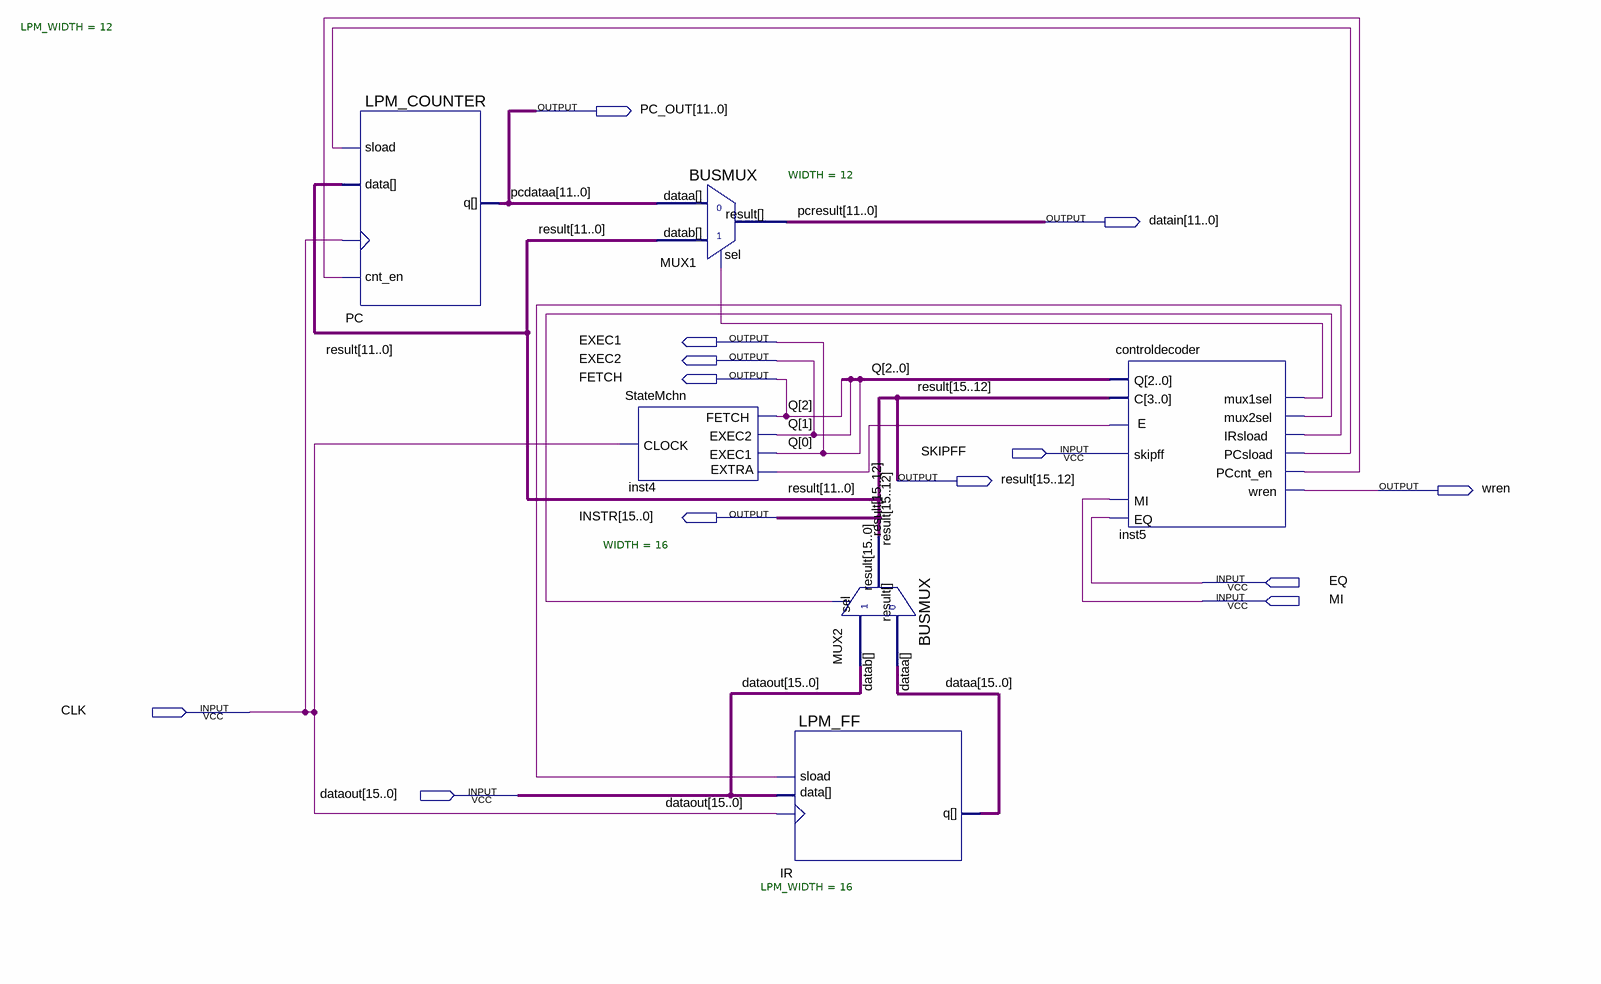
[diagram p0: schematic sheet]
// Quartus schematic ControlPath.bdf as structural Verilog: 6 symbols, 13 pins
module ControlPath (
  input  SKIPFF,
  input  EQ,
  input  MI,
  input  CLK,
  input  [15:0] dataout,
  output [11:0] PC_OUT,
  output [11:0] datain,
  output EXEC1,
  output EXEC2,
  output FETCH,
  output [15:12] result,
  output wren,
  output [15:0] INSTR
);

  wire inst5_e, inst5_irsload, inst5_mux1sel, inst5_mux2sel, inst5_pccnt_en, inst5_pcsload;
  wire [15:0] dataa;

  LPM_COUNTER #(.LPM_WIDTH(12)) PC (
    .clock(CLK), .cnt_en(inst5_pccnt_en), .data(INSTR[11:0]), .sload(inst5_pcsload), .q(PC_OUT));
  StateMchn inst4 (.EXTRA(inst5_e), .CLOCK(CLK), .FETCH(FETCH), .EXEC2(EXEC2), .EXEC1(EXEC1));
  BUSMUX #(.WIDTH(12)) MUX1 (.datab(INSTR[11:0]), .sel(inst5_mux1sel), .dataa(PC_OUT), .result(datain));
  LPM_FF #(.LPM_WIDTH(16)) IR (.clock(CLK), .data(dataout), .sload(inst5_irsload), .q(dataa));
  BUSMUX #(.WIDTH(16)) MUX2 (.datab(dataout), .sel(inst5_mux2sel), .dataa(dataa), .result(INSTR));
  controldecoder inst5 (
    .Q({FETCH, EXEC2, EXEC1}), .C(INSTR[15:12]), .MI(MI), .EQ(EQ), .skipff(SKIPFF), .E(inst5_e),
    .mux1sel(inst5_mux1sel), .mux2sel(inst5_mux2sel), .IRsload(inst5_irsload), .PCsload(inst5_pcsload),
    .PCcnt_en(inst5_pccnt_en), .wren(wren));

  assign result = INSTR[15:12];

  // Other names for the same wires on the sheet: Q[2:0] = {FETCH, EXEC2, EXEC1}; pcdataa[11:0] = PC_OUT;
  //   pcresult[11:0] = datain; result[11:0] = INSTR[11:0]
endmodule
